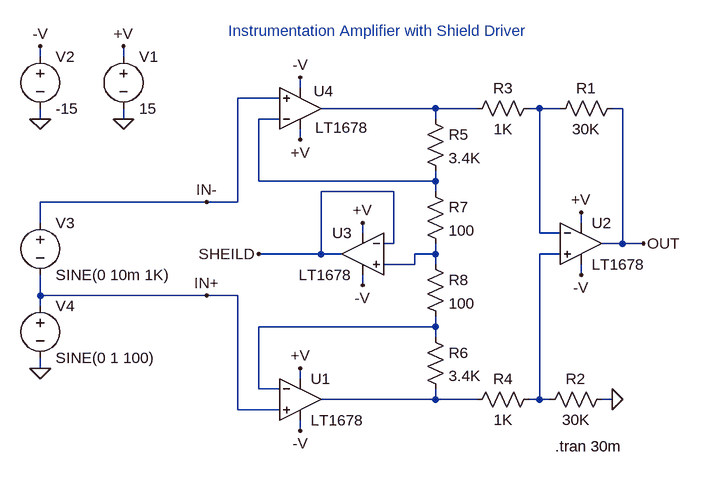
[diagram p0: schematic 1678.asc]
1678.asc, the LTspice schematic file:
Version 4
SHEET 1 2696 680
WIRE -256 -288 -256 -304
WIRE -128 -288 -128 -304
WIRE 144 -240 144 -256
WIRE 112 -224 48 -224
WIRE 352 -208 176 -208
WIRE 416 -208 352 -208
WIRE 512 -208 496 -208
WIRE 544 -208 512 -208
WIRE 640 -208 624 -208
WIRE -256 -192 -256 -208
WIRE -128 -192 -128 -208
WIRE 112 -192 80 -192
WIRE 352 -192 352 -208
WIRE 144 -160 144 -176
WIRE 80 -96 80 -192
WIRE 352 -96 352 -112
WIRE 352 -96 80 -96
WIRE 288 -80 176 -80
WIRE 352 -80 352 -96
WIRE 0 -64 -256 -64
WIRE 48 -64 48 -224
WIRE 48 -64 0 -64
WIRE -256 -32 -256 -64
WIRE 576 -32 576 -48
WIRE 240 -16 240 -32
WIRE 512 -16 512 -208
WIRE 544 -16 512 -16
WIRE 288 0 288 -80
WIRE 288 0 272 0
WIRE 640 0 640 -208
WIRE 640 0 608 0
WIRE 672 0 640 0
WIRE 176 16 176 -80
WIRE 176 16 80 16
WIRE 208 16 176 16
WIRE 352 16 352 0
WIRE 352 16 320 16
WIRE 544 16 512 16
WIRE 320 32 320 16
WIRE 320 32 272 32
WIRE 352 32 352 16
WIRE 576 48 576 32
WIRE 240 64 240 48
WIRE -256 80 -256 48
WIRE 0 80 -256 80
WIRE 48 80 0 80
WIRE -256 96 -256 80
WIRE 352 128 352 112
WIRE 352 128 80 128
WIRE 352 144 352 128
WIRE -256 192 -256 176
WIRE 144 208 144 192
WIRE 80 224 80 128
WIRE 112 224 80 224
WIRE 352 240 352 224
WIRE 352 240 176 240
WIRE 416 240 352 240
WIRE 512 240 512 16
WIRE 512 240 496 240
WIRE 528 240 512 240
WIRE 624 240 608 240
WIRE 48 256 48 80
WIRE 112 256 48 256
WIRE 144 288 144 272
FLAG -128 -192 0
FLAG 144 192 +V
FLAG -128 -304 +V
FLAG 144 288 -V
FLAG -256 -192 0
FLAG -256 -304 -V
FLAG 576 -48 +V
FLAG 576 48 -V
FLAG 240 -32 +V
FLAG 240 64 -V
FLAG 144 -160 +V
FLAG 144 -256 -V
FLAG 624 240 0
FLAG 0 -64 IN-
FLAG 0 80 IN+
FLAG -256 192 0
FLAG 672 0 OUT
FLAG 80 16 SHEILD
SYMBOL voltage -128 -304 R0
SYMATTR InstName V1
SYMATTR Value 15
SYMBOL voltage -256 -304 R0
SYMATTR InstName V2
SYMATTR Value -15
SYMBOL opamps\\LT1678 144 240 R0
SYMATTR InstName U1
SYMBOL opamps\\LT1678 576 0 R0
SYMATTR InstName U2
SYMBOL opamps\\LT1678 240 16 M0
SYMATTR InstName U3
SYMBOL opamps\\LT1678 144 -208 M180
WINDOW 0 21 27 Left 2
WINDOW 3 23 -29 Left 2
SYMATTR InstName U4
SYMBOL res 640 -224 R90
WINDOW 0 0 56 VBottom 2
WINDOW 3 32 56 VTop 2
SYMATTR InstName R1
SYMATTR Value 30K
SYMBOL res 624 224 R90
WINDOW 0 0 56 VBottom 2
WINDOW 3 32 56 VTop 2
SYMATTR InstName R2
SYMATTR Value 30K
SYMBOL res 512 -224 R90
WINDOW 0 0 56 VBottom 2
WINDOW 3 32 56 VTop 2
SYMATTR InstName R3
SYMATTR Value 1K
SYMBOL res 512 224 R90
WINDOW 0 0 56 VBottom 2
WINDOW 3 32 56 VTop 2
SYMATTR InstName R4
SYMATTR Value 1K
SYMBOL res 336 -208 R0
SYMATTR InstName R5
SYMATTR Value 3.4K
SYMBOL res 336 128 R0
SYMATTR InstName R6
SYMATTR Value 3.4K
SYMBOL res 336 -96 R0
SYMATTR InstName R7
SYMATTR Value 100
SYMBOL res 336 16 R0
SYMATTR InstName R8
SYMATTR Value 100
SYMBOL voltage -256 -48 R0
WINDOW 123 0 0 Left 2
WINDOW 39 0 0 Left 2
SYMATTR InstName V3
SYMATTR Value SINE(0 10m 1K)
SYMBOL voltage -256 80 R0
WINDOW 123 0 0 Left 2
WINDOW 39 0 0 Left 2
SYMATTR InstName V4
SYMATTR Value SINE(0 1 100)
TEXT 536 312 Left 2 !.tran 30m
TEXT 264 -312 Bottom 2 ;Instrumentation Amplifier with Shield Driver

The netlist it stands for:
* 1678.asc
V1 +V 0 15
V2 -V 0 -15
XU1 IN+ N006 N007 +V -V LT1678  ; pins In+ In- OUT V+ V-
XU2 N005 N002 OUT +V -V LT1678  ; pins In+ In- OUT V+ V-
XU3 N004 SHEILD SHEILD +V -V LT1678  ; pins In+ In- OUT V+ V-
XU4 IN- N003 N001 +V -V LT1678  ; pins In+ In- OUT V+ V-
R1 OUT N002 30K
R2 0 N005 30K
R3 N002 N001 1K
R4 N005 N007 1K
R5 N001 N003 3.4K
R6 N006 N007 3.4K
R7 N003 N004 100
R8 N004 N006 100
V3 IN- IN+ SINE(0 10m 1K)
V4 IN+ 0 SINE(0 1 100)
.tran 30m
* Instrumentation Amplifier with Shield Driver
.backanno
.end